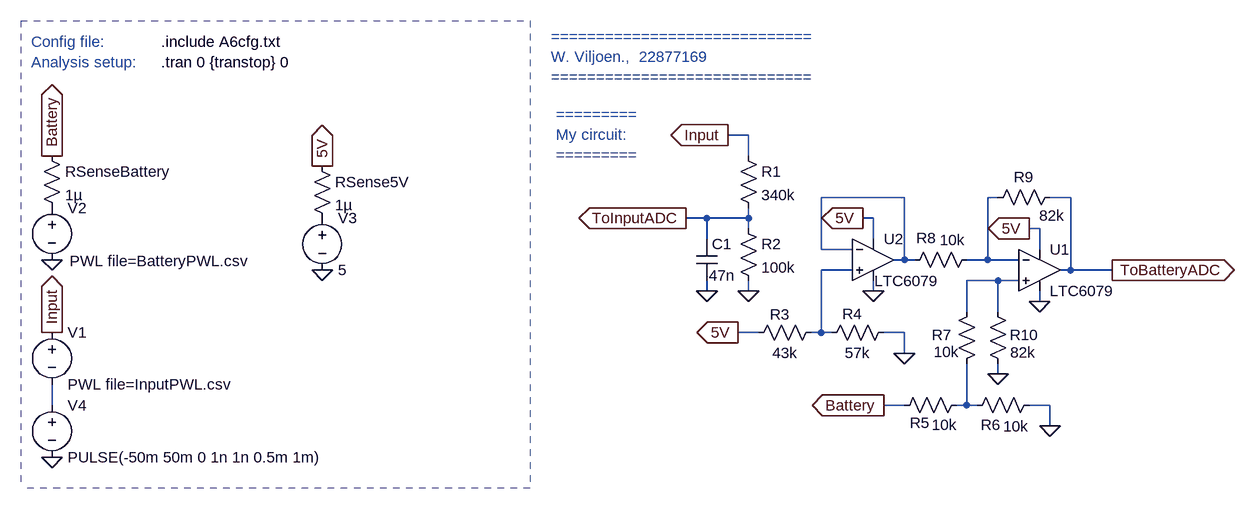
[diagram p0: schematic E344_22877169_A6.asc]
E344_22877169_A6.asc, the LTspice schematic file:
Version 4
SHEET 1 1824 680
WIRE -1248 -1248 -1280 -1248
WIRE -1248 -1216 -1248 -1248
WIRE -1008 -1152 -1136 -1152
WIRE -864 -1152 -880 -1152
WIRE -752 -1152 -784 -1152
WIRE -1312 -1120 -1344 -1120
WIRE -1248 -1120 -1248 -1136
WIRE -1248 -1120 -1312 -1120
WIRE -1056 -1120 -1072 -1120
WIRE -1248 -1104 -1248 -1120
WIRE -800 -1104 -816 -1104
WIRE -1312 -1088 -1312 -1120
WIRE -1056 -1088 -1056 -1120
WIRE -1136 -1072 -1136 -1152
WIRE -1088 -1072 -1136 -1072
WIRE -800 -1072 -800 -1104
WIRE -1008 -1056 -1008 -1152
WIRE -1008 -1056 -1024 -1056
WIRE -992 -1056 -1008 -1056
WIRE -880 -1056 -880 -1152
WIRE -880 -1056 -912 -1056
WIRE -832 -1056 -880 -1056
WIRE -1088 -1040 -1136 -1040
WIRE -752 -1040 -752 -1152
WIRE -752 -1040 -768 -1040
WIRE -688 -1040 -752 -1040
WIRE -864 -1024 -912 -1024
WIRE -832 -1024 -864 -1024
WIRE -1312 -1008 -1312 -1024
WIRE -1248 -1008 -1248 -1024
WIRE -1056 -1008 -1056 -1024
WIRE -800 -992 -800 -1008
WIRE -912 -976 -912 -1024
WIRE -864 -976 -864 -1024
WIRE -1232 -944 -1264 -944
WIRE -1136 -944 -1136 -1040
WIRE -1136 -944 -1152 -944
WIRE -1120 -944 -1136 -944
WIRE -1008 -944 -1040 -944
WIRE -1008 -912 -1008 -944
WIRE -864 -880 -864 -896
WIRE -2320 -832 -2320 -864
WIRE -1008 -832 -1040 -832
WIRE -912 -832 -912 -896
WIRE -912 -832 -928 -832
WIRE -896 -832 -912 -832
WIRE -784 -832 -816 -832
WIRE -784 -800 -784 -832
FLAG -2320 -944 Input
IOPIN -2320 -944 Out
FLAG -1904 -1040 0
FLAG -2320 -752 0
FLAG -2320 -1056 0
FLAG -1344 -1120 ToInputADC
IOPIN -1344 -1120 Out
FLAG -688 -1040 ToBatteryADC
IOPIN -688 -1040 Out
FLAG -1904 -1200 5V
IOPIN -1904 -1200 Out
FLAG -2320 -1216 Battery
IOPIN -2320 -1216 Out
FLAG -1040 -832 Battery
IOPIN -1040 -832 Out
FLAG -1280 -1248 Input
IOPIN -1280 -1248 Out
FLAG -1248 -1008 0
FLAG -1312 -1008 0
FLAG -1008 -912 0
FLAG -784 -800 0
FLAG -800 -992 0
FLAG -816 -1104 5V
IOPIN -816 -1104 Out
FLAG -1072 -1120 5V
IOPIN -1072 -1120 Out
FLAG -1056 -1008 0
FLAG -1264 -944 5V
IOPIN -1264 -944 Out
FLAG -864 -880 0
SYMBOL voltage -2320 -960 R0
WINDOW 123 0 0 Left 0
WINDOW 39 0 0 Left 0
SYMATTR InstName V1
SYMATTR Value PWL file=InputPWL.csv
SYMBOL voltage -2320 -1152 R0
WINDOW 123 0 0 Left 0
WINDOW 39 0 0 Left 0
WINDOW 3 27 98 Left 2
SYMATTR Value PWL file=BatteryPWL.csv
SYMATTR InstName V2
SYMBOL voltage -1904 -1136 R0
WINDOW 123 0 0 Left 0
WINDOW 39 0 0 Left 0
SYMATTR InstName V3
SYMATTR Value 5
SYMBOL voltage -2320 -848 R0
WINDOW 123 0 0 Left 0
WINDOW 39 0 0 Left 0
SYMATTR InstName V4
SYMATTR Value PULSE(-50m 50m 0 1n 1n 0.5m 1m)
SYMBOL res -1920 -1216 R0
SYMATTR InstName RSense5V
SYMATTR Value 1µ
SYMBOL res -2336 -1232 R0
SYMATTR InstName RSenseBattery
SYMATTR Value 1µ
SYMBOL LTC6079 -800 -1040 R0
SYMATTR InstName U1
SYMBOL LTC6079 -1056 -1056 R0
WINDOW 3 2 33 Left 2
SYMATTR InstName U2
SYMBOL res -1264 -1232 R0
SYMATTR InstName R1
SYMATTR Value 340k
SYMBOL res -1264 -1120 R0
SYMATTR InstName R2
SYMATTR Value 100k
SYMBOL cap -1328 -1088 R0
WINDOW 3 19 56 Left 2
SYMATTR InstName C1
SYMATTR Value 47n
SYMBOL res -1248 -928 R270
WINDOW 0 28 48 VTop 2
WINDOW 3 0 56 VBottom 2
SYMATTR InstName R3
SYMATTR Value 43k
SYMBOL res -1136 -928 R270
WINDOW 0 29 48 VTop 2
WINDOW 3 0 56 VBottom 2
SYMATTR InstName R4
SYMATTR Value 57k
SYMBOL res -1024 -816 R270
WINDOW 0 -27 40 VTop 2
WINDOW 3 1 78 VBottom 2
SYMATTR InstName R5
SYMATTR Value 10k
SYMBOL res -912 -816 R270
WINDOW 0 -30 37 VTop 2
WINDOW 3 -1 76 VBottom 2
SYMATTR InstName R6
SYMATTR Value 10k
SYMBOL res -896 -992 M0
WINDOW 0 39 52 Left 2
WINDOW 3 28 78 Left 2
SYMATTR InstName R7
SYMATTR Value 10k
SYMBOL res -896 -1072 R90
WINDOW 0 -2 78 VBottom 2
WINDOW 3 -30 38 VTop 2
SYMATTR InstName R8
SYMATTR Value 10k
SYMBOL res -768 -1168 R90
WINDOW 0 0 56 VBottom 2
WINDOW 3 28 13 VTop 2
SYMATTR InstName R9
SYMATTR Value 82k
SYMBOL res -880 -992 R0
WINDOW 0 34 52 Left 2
WINDOW 3 35 79 Left 2
SYMATTR InstName R10
SYMATTR Value 82k
TEXT -2152 -1360 Left 2 !.tran 0 {transtop} 0
TEXT -2152 -1392 Left 2 !.include A6cfg.txt
TEXT -2352 -1392 Left 2 ;Config file:
TEXT -2352 -1360 Left 2 ;Analysis setup:
TEXT -1552 -1400 Left 2 ;=============================\nW. Viljoen.,  22877169\n=============================
TEXT -1544 -1280 Left 2 ;=========\nMy circuit:\n=========
LINE Normal -1584 -1424 -1584 -704 2
LINE Normal -2368 -1424 -1584 -1424 2
LINE Normal -1584 -704 -2368 -704 2
LINE Normal -1584 -720 -1584 -720 2
LINE Normal -2368 -1424 -2368 -704 2

The netlist it stands for:
* E344_22877169_A6.asc
V1 Input N005 PWL file=InputPWL.csv
V2 P001 0 PWL file=BatteryPWL.csv
V3 P002 0 5
V4 N005 0 PULSE(-50m 50m 0 1n 1n 0.5m 1m)
RSense5V 5V P002 1µ
RSenseBattery Battery P001 1µ
XU1 N004 N002 5V 0 ToBatteryADC LTC6078  ; LTC6079, pins In+ In- V+ V- OUT
XU2 N003 N001 5V 0 N001 LTC6078  ; LTC6079, pins In+ In- V+ V- OUT
R1 Input ToInputADC 340k
R2 ToInputADC 0 100k
C1 ToInputADC 0 47n
R3 5V N003 43k
R4 N003 0 57k
R5 Battery N006 10k
R6 N006 0 10k
R7 N004 N006 10k
R8 N002 N001 10k
R9 ToBatteryADC N002 82k
R10 N004 0 82k
.tran 0 {transtop} 0
.include A6cfg.txt
* Config file:
* Analysis setup:
* =============================
* W. Viljoen.,  22877169
* =============================
* =========
* My circuit:
* =========
.lib LTC5.lib
.backanno
.end